# Altium schematic sheet 最小系统 - 正点原子.SchDoc
size A4
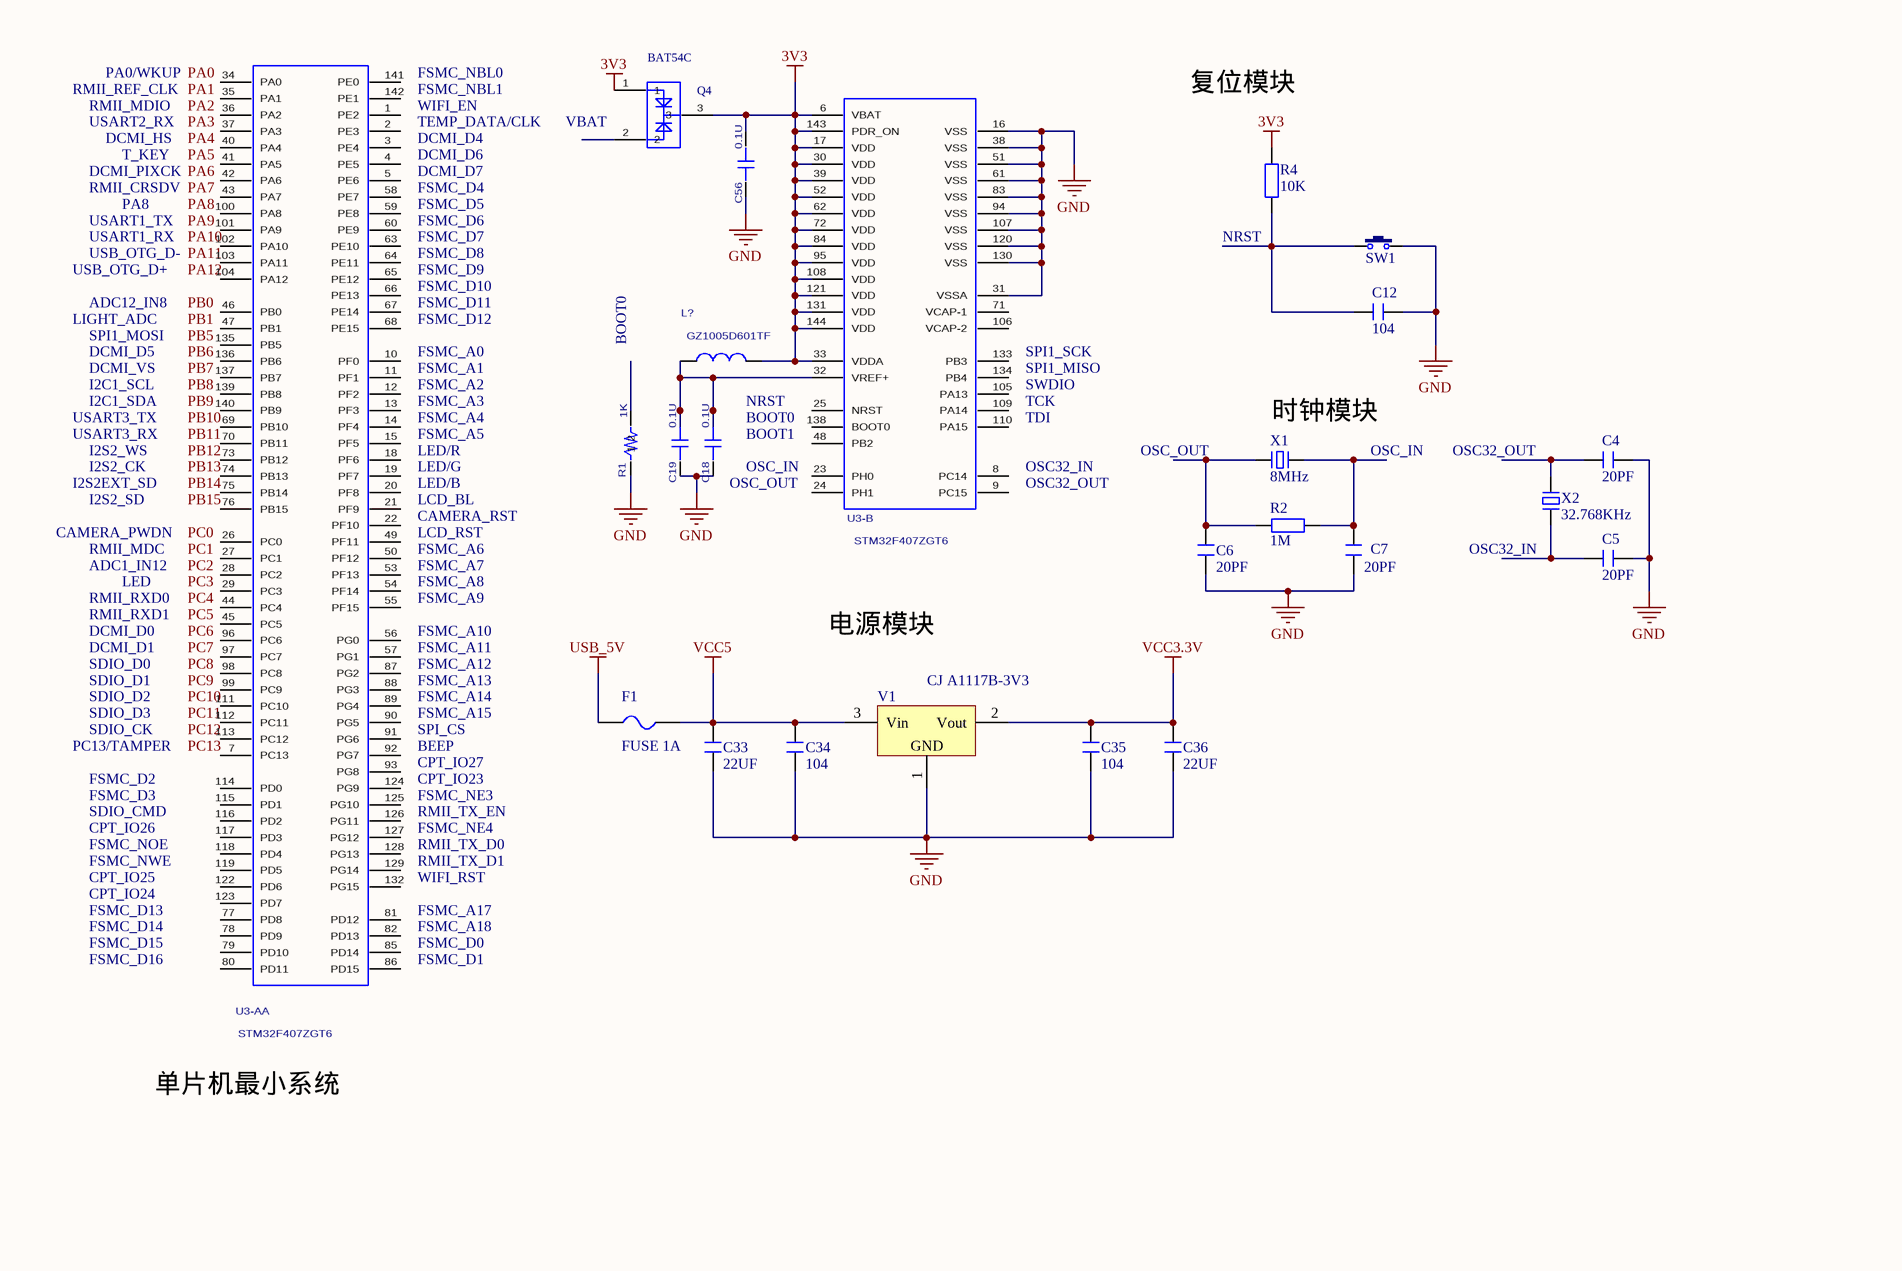
[diagram p0: 最小系统 - 正点原子.SchDoc]

## Parts
C4  20PF  [C 0402]
C5  20PF  [C 0402]
C6  20PF  [C 0402]
C7  20PF  [C 0402]
C12  104  [C 0402]
C18  value 0.1U  [SC0402]  (hidden comment: C_10P_0402)
C19  value 0.1U  [SC0402]  (hidden comment: C_10P_0402)
C33  22UF  [C 0402]
C34  104  [C 0402]
C35  104  [C 0402]
C36  22UF  [C 0402]
C56  value 0.1U  [SC0402]  (hidden comment: C_10P_0402)
F1  FUSE 1A  [FU 0805]
L?  GZ1005D601TF  [SR0402]
Q4  BAT54C  [SOT-23]  (value not drawn)
R1  value 1K  [SR0402]  (hidden comment: R_1K_0402)
R2  1M  [R 0402]
R4  10K  [R 0402]
SW1  3x6x5  [TSW SMD-3*4*2.5]  (value not drawn)
U3-  STM32F407ZGT6  [LC-LQFP-144_20X20X05P]  (part B of 2)
U3-A  STM32F407ZGT6  [LC-LQFP-144_20X20X05P]  (part A of 2)
V1  CJ A1117B-3V3  [SOT89_L]
X1  8MHz  [OSC 3215-2P]
X2  32.768KHz  [OSC 3215-2P]

## Nets
3V3: C56.2 L?.2 Q4.1 Q4.3 R4.2 U3-.6(VBAT) U3-.17(VDD) U3-.30(VDD) U3-.33(VDDA) U3-.39(VDD) U3-.52(VDD) U3-.62(VDD) U3-.72(VDD) U3-.84(VDD) U3-.95(VDD) U3-.108(VDD) U3-.121(VDD) U3-.131(VDD) U3-.143(PDR_ON) U3-.144(VDD)
GND: C4.1 C5.1 C6.2 C7.2 C12.2 C18.1 C19.1 C33.1 C34.1 C35.1 C36.1 C56.1 R1.1 SW1.2 U3-.16(VSS) U3-.31(VSSA) U3-.38(VSS) U3-.51(VSS) U3-.61(VSS) U3-.83(VSS) U3-.94(VSS) U3-.107(VSS) U3-.120(VSS) U3-.130(VSS) V1.1(GND)
USB_5V: F1.1
VCC3.3V: C35.2 C36.2 V1.2(Vout)
VCC5: C33.2 C34.2 F1.2 V1.3(Vin)
NetC4_2: C4.2 X2.2
NetC5_2: C5.2 X2.1
NetC6_1: C6.1 R2.1 X1.2
NetC7_1: C7.1 R2.2 X1.1
NetC12_1: C12.1 R4.1 SW1.1
NetC18_2: C18.2 C19.2 L?.1 U3-.32(VREF+)

Not connected (* = marked no-connect by the designer): Q4 2; R1 2; U3- 8(PC14) 9(PC15) 23(PH0) 24(PH1) 25(NRST) 48(PB2) 71(VCAP-1) 105(PA13) 106(VCAP-2) 109(PA14) 110(PA15) 133(PB3) 134(PB4) 138(BOOT0); U3-A 1(PE2) 2(PE3) 3(PE4) 4(PE5) 5(PE6) 7(PC13) 10(PF0) 11(PF1) 12(PF2) 13(PF3) 14(PF4) 15(PF5) 18(PF6) 19(PF7) 20(PF8) 21(PF9) 22(PF10) 26(PC0) 27(PC1) 28(PC2) 29(PC3) 34(PA0) 35(PA1) 36(PA2) 37(PA3) 40(PA4) 41(PA5) 42(PA6) 43(PA7) 44(PC4) 45(PC5) 46(PB0) 47(PB1) 49(PF11) 50(PF12) 53(PF13) 54(PF14) 55(PF15) 56(PG0) 57(PG1) 58(PE7) 59(PE8) 60(PE9) 63(PE10) 64(PE11) 65(PE12) 66(PE13) 67(PE14) 68(PE15) 69(PB10) 70(PB11) 73(PB12) 74(PB13) 75(PB14) 76(PB15) 77(PD8) 78(PD9) 79(PD10) 80(PD11) 81(PD12) 82(PD13) 85(PD14) 86(PD15) 87(PG2) 88(PG3) 89(PG4) 90(PG5) 91(PG6) 92(PG7) 93(PG8) 96(PC6) 97(PC7) 98(PC8) 99(PC9) 100(PA8) 101(PA9) 102(PA10) 103(PA11) 104(PA12) 111(PC10) 112(PC11) 113(PC12) 114(PD0) 115(PD1) 116(PD2) 117(PD3) 118(PD4) 119(PD5) 122(PD6) 123(PD7) 124(PG9) 125(PG10) 126(PG11) 127(PG12) 128(PG13) 129(PG14) 132(PG15) 135(PB5) 136(PB6) 137(PB7) 139(PB8) 140(PB9) 141(PE0) 142(PE1)

## Notes on the sheet
- (near Q4) BAT54C
- RMII_REF_CLK
- RMII_MDIO
- USART2_RX
- PA0/WKUP
- DCMI_HS
- (near U3-A) FSMC_NBL0
- (near U3-A) FSMC_NBL1
- (near U3-A) WIFI_EN
- (near U3-A) TEMP_DATA/CLK
- (near U3-A) DCMI_D4
- (near Q4) VBAT
- (near Q4) Q4
- 复位模块
- DCMI_PIXCK
- RMII_CRSDV
- USART1_TX
- T_KEY
- PA8
- (near U3-A) DCMI_D6
- (near U3-A) DCMI_D7
- (near U3-A) FSMC_D4
- (near U3-A) FSMC_D5
- (near U3-A) FSMC_D6
- USB_OTG_D+
- USART1_RX
- USB_OTG_D-
- ADC12_IN8
- (near U3-A) FSMC_D7
- (near U3-A) FSMC_D8
- (near U3-A) FSMC_D9
- (near U3-A) FSMC_D10
- (near U3-A) FSMC_D11
- (near R4) NRST
- LIGHT_ADC
- SPI1_MOSI
- DCMI_D5
- DCMI_VS
- I2C1_SCL
- (near U3-A) FSMC_D12
- (near U3-A) FSMC_A0
- (near U3-A) FSMC_A1
- (near U3-A) FSMC_A2
- BOOT0
- (near U3-) SPI1_SCK
- (near U3-) SPI1_MISO
- (near U3-) SWDIO
- USART3_TX
- USART3_RX
- I2C1_SDA
- I2S2_WS
- I2S2_CK
- (near U3-A) FSMC_A3
- (near U3-A) FSMC_A4
- (near U3-A) FSMC_A5
- (near U3-A) LED/R
- (near U3-A) LED/G
- NRST
- (near C18) BOOT1
- OSC_IN
- (near U3-) TCK
- (near U3-) TDI
- (near U3-) OSC32_IN
- OSC_OUT
- (near X1) 时钟模块
- (near X2) OSC32_OUT
- CAMERA_PWDN
- I2S2EXT_SD
- I2S2_SD
- RMII_MDC
- (near U3-A) LED/B
- (near U3-A) LCD_BL
- (near U3-A) CAMERA_RST
- (near U3-A) FSMC_A6
- (near U3-A) LCD_RST
- (near C18) OSC_OUT
- (near U3-) OSC32_OUT
- (near X2) OSC32_IN
- ADC1_IN12
- RMII_RXD0
- RMII_RXD1
- DCMI_D0
- LED
- (near U3-A) FSMC_A7
- (near U3-A) FSMC_A8
- (near U3-A) FSMC_A9
- (near U3-A) FSMC_A10
- 电源模块
- DCMI_D1
- SDIO_D0
- SDIO_D1
- SDIO_D2
- SDIO_D3
- (near U3-A) FSMC_A11
- (near U3-A) FSMC_A12
- (near U3-A) FSMC_A13
- (near U3-A) FSMC_A15
- (near U3-A) FSMC_A14
- PC13/TAMPER
- SDIO_CK
- FSMC_D2
- FSMC_D3
- (near U3-A) SPI_CS
- (near U3-A) BEEP
- (near U3-A) CPT_IO27
- (near U3-A) CPT_IO23
- (near U3-A) FSMC_NE3
- SDIO_CMD
- CPT_IO26
- FSMC_NOE
- FSMC_NWE
- CPT_IO25
- (near U3-A) RMII_TX_EN
- (near U3-A) FSMC_NE4
- (near U3-A) RMII_TX_D0
- (near U3-A) RMII_TX_D1
- (near U3-A) WIFI_RST
- CPT_IO24
- FSMC_D13
- FSMC_D14
- FSMC_D15
- FSMC_D16
- (near U3-A) FSMC_A17
- (near U3-A) FSMC_D0
- (near U3-A) FSMC_A18
- (near U3-A) FSMC_D1
- 单片机最小系统
- Labels drawn without touching a wire or pin: PA1, PA2, PA3, PA4, PA5, PA6, PA7, PA8, PA9, PA10, PA11, PA12, PB0, PB1, PB5, PB6, PB7, PB8, PB9, PB10, PB11, PB12, PB13, PB14, PB15, PC0, PC1, PC2, PC3, PC4, PC5, PC6, PC7, PC8, PC9, PC10, PC11, PC12, PC13

## Library data of the parts
C4-C7 C12 C33-C36 = C: 无极性贴片电容; 版权归属: 源创客; 材质: X7R; BOM名称: 无极性贴片电容; 学习资源: www.ooocke.com
F1 = FU: 贴片保险丝; 版权归属: 源创客; BOM名称: 贴片保险丝; 学习资源: www.ooocke.com
R2 R4 = R: 贴片电阻; 版权归属: 源创客; BOM名称: 贴片电阻; 学习资源: www.ooocke.com
SW1 = TSW: 轻触开关; BOM名称: 3x6轻触开关; 版权归属: 源创客; 学习资源: www.ooocke.com
V1 = AMS1117: 三端稳压芯片; BOM名称: 稳压芯片; 版权归属: 源创客; 学习资源: www.ooocke.com
X1 X2 = XTAL-2P: 2脚无源脚晶振; 版权归属: 源创客; 负载电容: CL20pF; BOM名称: 2脚无源脚晶振; 学习资源: www.ooocke.com
C18 C19 C56 = C_10P_0402: PCB DECAL: SC0402
L? = GZ1005D601TF: Value: GZ1005D601TF; PCB DECAL: SR0402
Q4 = BAT54C: Value: BAT54C; PCB DECAL: SOT-23
R1 = R_1K_0402: PCB DECAL: SR0402
U3- U3-A = STM32F407ZGT6: PCB DECAL: LC-LQFP-144_20X20X05P; Value: STM32F407ZG